# EAGLE design Mood-Light-Perhaps (EAGLE 9.6.2)
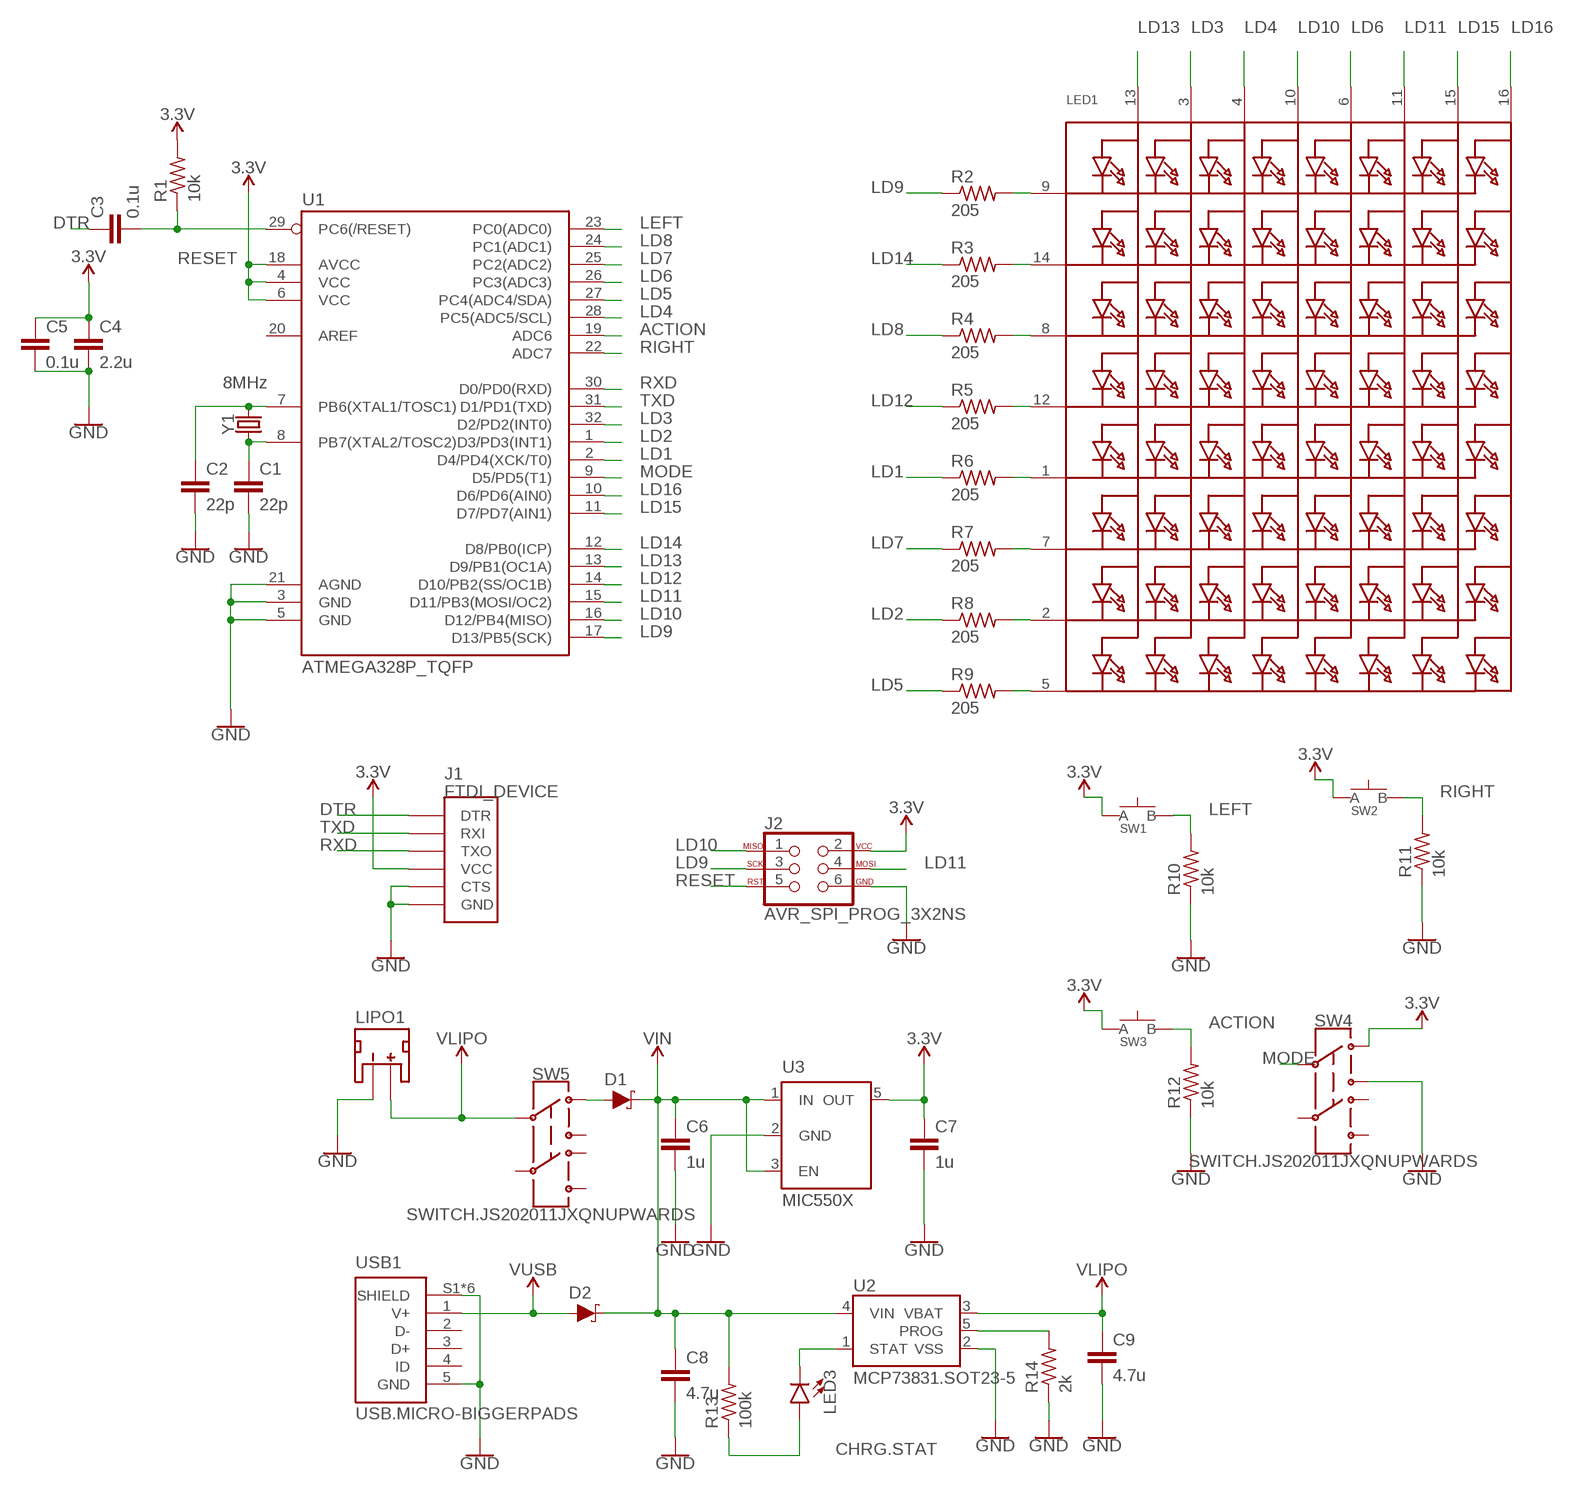
[diagram p0: schematic, sheet 1]

## Parts
C1  22p  CAPACITOR0603  [C0603]
C2  22p  CAPACITOR0603  [C0603]
C3  0.1u  CAPACITOR0603  [C0603]
C4  2.2u  CAPACITOR0603  [C0603]
C5  0.1u  CAPACITOR0603  [C0603]
C6  1u  CAPACITOR0603  [C0603]
C7  1u  CAPACITOR0603  [C0603]
C8  4.7u  CAPACITOR0603  [C0603]
C9  4.7u  CAPACITOR0603  [C0603]
D1  SCHOTTKY-USC  [USC]
D2  SCHOTTKY-USC  [USC]
J1  FTDI_DEVICE  [FTDI_DEVICE]
J2  AVR_SPI_PROG_3X2NS  [2X3-NS]
LED1  DOTMATRIX_8X8_ROWCATHODEM12A881UR  [DOTMATRIX_BL-M12A881UR]
LED3  LED0805  [LED-0805]
LIPO1  JST_2MM_MALE  [JST-2-SMD]
R1  10k  RESISTOR0603  [R0603]
R2  205  RESISTOR0603  [R0603]
R3  205  RESISTOR0603  [R0603]
R4  205  RESISTOR0603  [R0603]
R5  205  RESISTOR0603  [R0603]
R6  205  RESISTOR0603  [R0603]
R7  205  RESISTOR0603  [R0603]
R8  205  RESISTOR0603  [R0603]
R9  205  RESISTOR0603  [R0603]
R10  10k  RESISTOR0603  [R0603]
R11  10k  RESISTOR0603  [R0603]
R12  10k  RESISTOR0603  [R0603]
R13  100k  RESISTOR0603  [R0603]
R14  2k  RESISTOR0603  [R0603]
SW1  SPST.KT11P4SM34LFS  [SPST.KT11P4SM34LFS]
SW2  SPST.KT11P4SM34LFS  [SPST.KT11P4SM34LFS]
SW3  SPST.KT11P4SM34LFS  [SPST.KT11P4SM34LFS]
SW4  SWITCH.JS202011JXQNUPWARDS  [SWITCH.00]
SW5  SWITCH.JS202011JXQNUPWARDS  [SWITCH.00]
U1  ATMEGA328P_TQFP  [TQFP32-08]
U2  MCP73831.SOT23-5  [SOT23-5]
U3  MIC550X  [SOT23-5]
USB1  USB.MICRO-BIGGERPADS  [USB-MICRO-01.BIGGERPADS]
Y1  8MHz  CRYSTAL-CA-310  [CA-301]

## Nets
3.3V: C4.1 C5.1 C7.1 J1.VCC J2.2 R1.2 SW1.1(A) SW1.2(A) SW2.1(A) SW2.2(A) SW3.1(A) SW3.2(A) SW4.1 U1.4(VCC) U1.6(VCC) U1.18(AVCC) U3.5(OUT)
ACTION: R12.2 SW3.3(B) SW3.4(B) U1.19(ADC6)
CHRG.STAT: LED3.A R13.1
DTR: C3.1 J1.DTR
GND: C1.2 C2.2 C4.2 C5.2 C6.2 C7.2 C8.2 C9.2 J1.CTS J1.GND J2.6 LIPO1.1(-) R10.1 R11.1 R12.1 R14.1 SW4.3 U1.3(GND) U1.5(GND) U1.21(AGND) U2.2(VSS) U3.2(GND) USB1.5(GND) USB1.S1(SHIELD) USB1.S2(SHIELD) USB1.S3(SHIELD) USB1.S4(SHIELD) USB1.S5(SHIELD) USB1.S6(SHIELD)
LD1: R6.1 U1.2(D4/PD4(XCK/T0))
LD2: R8.1 U1.1(D3/PD3(INT1))
LD3: LED1.3(A2) U1.32(D2/PD2(INT0))
LD4: LED1.4(A3) U1.28(PC5(ADC5/SCL))
LD5: R9.1 U1.27(PC4(ADC4/SDA))
LD6: LED1.6(A5) U1.26(PC3(ADC3))
LD7: R7.1 U1.25(PC2(ADC2))
LD8: R4.1 U1.24(PC1(ADC1))
LD9: J2.3 R2.1 U1.17(D13/PB5(SCK))
LD10: J2.1 LED1.10(A4) U1.16(D12/PB4(MISO))
LD11: J2.4 LED1.11(A6) U1.15(D11/PB3(MOSI/OC2))
LD12: R5.1 U1.14(D10/PB2(SS/OC1B))
LD13: LED1.13(A1) U1.13(D9/PB1(OC1A))
LD14: R3.1 U1.12(D8/PB0(ICP))
LD15: LED1.15(A7) U1.11(D7/PD7(AIN1))
LD16: LED1.16(A8) U1.10(D6/PD6(AIN0))
LEFT: R10.2 SW1.3(B) SW1.4(B) U1.23(PC0(ADC0))
MODE: SW4.2 U1.9(D5/PD5(T1))
N$1: LED1.9(K1) R2.2
N$2: C2.1 U1.7(PB6(XTAL1/TOSC1)) Y1.2
N$3: C1.1 U1.8(PB7(XTAL2/TOSC2)) Y1.1
N$4: LED1.14(K2) R3.2
N$5: LED1.8(K3) R4.2
N$6: LED1.12(K4) R5.2
N$7: LED1.1(K5) R6.2
N$8: LED1.7(K6) R7.2
N$9: LED1.2(K7) R8.2
N$10: LED1.5(K8) R9.2
N$12: R14.2 U2.5(PROG)
N$13: D1.+(A) SW5.1
N$16: LED3.C U2.1(STAT)
RESET: C3.2 J2.5 R1.1 U1.29(PC6(/RESET))
RIGHT: R11.2 SW2.3(B) SW2.4(B) U1.22(ADC7)
RXD: J1.RXI(TXO) U1.30(D0/PD0(RXD))
TXD: J1.TXO(RXI) U1.31(D1/PD1(TXD))
V_USB: D2.+(A) USB1.1(V+) ; supply symbol labelled VUSB
VIN: C6.1 C8.1 D1.-(C) D2.-(C) R13.2 U2.4(VIN) U3.1(IN) U3.3(EN)
VLIPO: C9.1 LIPO1.2(+) SW5.2 U2.3(VBAT)
Unconnected: LIPO1.NC1(PAD1) LIPO1.NC2(PAD2) SW4.5 SW4.6 SW4.7 SW5.3 SW5.5 SW5.6 SW5.7 U1.20(AREF) USB1.2(D-) USB1.3(D+) USB1.4(ID)

## Library data of the parts
C1-C9 = LinnesLab-Passives:CAPACITOR
D1 D2 = LinnesLab-DiscreteSemi:SCHOTTKY: Schottky diode A Schottky diode is a semiconductor diode which has a low forward voltage drop and a very fast switching action. Example: Digi-Key Part Number: RB161MM-20CT-ND CST2 footprint - Manufacturer Part Number: CTS05S40,L3F
J1 = LinnesLab-Connectors:FTDI_DEVICE
J2 = LinnesLab-Connectors:AVR_SPI_PROG_3X2: AVR ISP 6 Pin This is the reduced ISP connector for AVR programming. Common on Arduino. This footprint will take up less PCB space and can be used with a 10-pin to 6-pin adapter such as SKU: BOB-08508 **Special note about "TEST_POINT" package. The stop mask is on the top side, so if you want your programming test points to be on the bottom of your board, make sure to place this package on the bottom side of the board. This also ensure that the orientation to program from the bottom side will be correct. SparkFun Products: SparkFun ISP Pogo Adapter <https://www.sparkfun.com/products/11591> - NS Tiny AVR Programmer <https://www.sparkfun.com/products/11801> -PTH
LED1 = LinnesLab-Displays:DOTMATRIX_8X8_ROWCATHODE: 8x8 LED Segment Displays: Row = Cathode 0.7" Red 8X8 Matrix, 1.9mm Round LEDs - BL-M07C881UR 1.2" Red 8x8 Matrix, 3.0mm Round LEDs - BL-M12A881UR 1.2" Red 8x8 Matrix, 3.0mm Square LEDs - BL-M12A883
LED3 = LinnesLab-LED:LED: LED (Generic) Standard schematic elements and footprints for 5mm, 3mm, 1206, and 0603 sized LEDs. Generic LEDs with no color specified. LTST-C190KGKT: arrow indicates cathode
LIPO1 = LinnesLab-Connectors:JST_2MM_MALE: JST 2MM MALE RA CONNECTOR Two pin, compact surface mount connector. Commonly used as a battery input connection point. We really like the solid locking feeling and high current rating on these small connectors. We use these all the time as battery connectors. Mates to single-cell LiPo batteries. Here is the connector we sell at SparkFun: JST Right Angle Connector - White <https://www.sparkfun.com/products/8612> (PRT-08612) Datasheet <http://www.sparkfun.com/datasheets/Prototyping/Connectors/JST-Horizontal.pdf> It was used on these SparkFun products: SparkFun MOSFET Power Controller <https://www.sparkfun.com/products/11214> (PRT-11214) SparkFun Battery Babysitter - LiPo Battery Manager <https://www.sparkfun.com/products/13777> (PRT-13777) And many, many others that required a lipo battery connection.; PROD_ID: CONN-11443; SF_ID: PRT-08612
R1-R14 = LinnesLab-Passives:RESISTOR
SW1-SW3 = LinnesLab-Switches:SPST.KT11P4SM34LFS: https://www.ckswitches.com/media/1468/kt.pdf
SW4 SW5 = LinnesLab-Switches:SWITCH.JS202011JXQN: Manufacturer's Part Numer: JS202011JAQN for right angle throw JS202011JCQN for top side throw
U1 = LinnesLab-Microcontrollers:ATMEGA328P_TQFP: Popular 328P in QFP Storefront component: ATmega328 - TQFP <https://www.sparkfun.com/products/13448> (COM-13448) Datasheet <http://www.sparkfun.com/datasheets/Components/SMD/ATMega328.pdf> SparkFun Products SparkFun RedBoard - Programmed with Arduino <https://www.sparkfun.com/products/12757> (DEV-12757) Arduino Pro Mini 328 - 5V/16MHz <https://www.sparkfun.com/products/11113> (DEV-11113) Arduino Pro Mini 328 - 3.3V/8MHz <https://www.sparkfun.com/products/11114> (DEV-11114) SparkFun OpenLog <https://www.sparkfun.com/products/13712> (DEV-13712) SparkFun MicroView - OLED Arduino Module <https://www.sparkfun.com/products/12923> (DEV-12923) SparkFun Digital Sandbox <https://www.sparkfun.com/products/12651> (DEV-12651) SparkFun PicoBoard <https://www.sparkfun.com/products/11888> (WIG-11888) Arduino Fio <https://www.sparkfun.com/products/10116> (DEV-10116) LilyPad Arduino 328 Main Board <https://www.sparkfun.com/products/13342> (DEV-13342) SparkFun RedStick <https://www.sparkfun.com/products/13741> (DEV-13741) LilyPad MP3 <https://www.sparkfun.com/products/11013> (DEV-11013) LilyPad Arduino SimpleSnap <https://www.sparkfun.com/products/10941> (DEV-10941) SparkFun Stepoko <https://www.sparkfun.com/products/13899> (ROB-13899) SparkFun Geiger Counter <https://www.sparkfun.com/products/11345> (SEN-11345) SparkFun EL Sequencer <https://www.sparkfun.com/products/12781> (COM-12781) Arduino Pro 328 - 5V/16MHz <https://www.sparkfun.com/products/10915> (DEV-10915) CryptoCape <https://www.sparkfun.com/products/12773> (DEV-12773) SparkFun IR Thermometer Evaluation Board - MLX90614 <https://www.sparkfun.com/products/10740> (SEN-10740) SparkFun RedBot Mainboard <https://www.sparkfun.com/products/12097> (ROB-12097) Arduino Pro 328 - 3.3V/8MHz <https://www.sparkfun.com/products/10914> (DEV-10914) SparkFun Block for Intel® Edison - Arduino <https://www.sparkfun.com/products/13036> (DEV-13036) SparkFun Simon Says - Surface Mount Soldering Kit <https://www.sparkfun.com/products/10935> (KIT-10935) SparkFun 7-Segment Serial Display - Red <https://www.sparkfun.com/products/11441> (COM-11441) SparkFun 7-Segment Serial Display - White <https://www.sparkfun.com/products/11629> (COM-11629) SparkFun 7-Segment Serial Display - Yellow <https://www.sparkfun.com/products/11443> (COM-11443) SparkFun 7-Segment Serial Display - Kelly Green <https://www.sparkfun.com/products/11440> (COM-11440) SparkFun 7-Segment Serial Display - Blue <https://www.sparkfun.com/products/11442> (COM-11442) SparkFun OpenSegment Serial Display - 20mm (Blue) <https://www.sparkfun.com/products/11647> (COM-11647) SparkFun OpenSegment Serial Display - 20mm (Green) <https://www.sparkfun.com/products/11646> (COM-11646) SparkFun OpenSegment Serial Display - 20mm (White) <https://www.sparkfun.com/products/11648> (COM-11648) SparkFun OpenSegment Serial Display - 20mm (Red) <https://www.sparkfun.com/products/11644> (COM-11644) SparkFun OpenSegment Serial Display - 20mm (Yellow) <https://www.sparkfun.com/products/11645> (COM-11645) SparkFun OpenSegment Shield <https://www.sparkfun.com/products/13190> (DEV-13190); PROD_ID: IC-09069
U2 = LinnesLab-Power:MCP73831
U3 = LinnesLab-Power:MIC550X: MIC5504 Voltage Regulator Output Voltages: 1.0V to 3.3V Input Voltages: 2.5V to 5.5V Link to Datasheet http://ww1.microchip.com/downloads/en/DeviceDoc/MIC550X.pdf
USB1 = LinnesLab-Connectors:USB.MICRO: DigiKey PN: 609-4613-1-ND
Y1 = LinnesLab-Clocks:CRYSTAL-CA-310

## Board
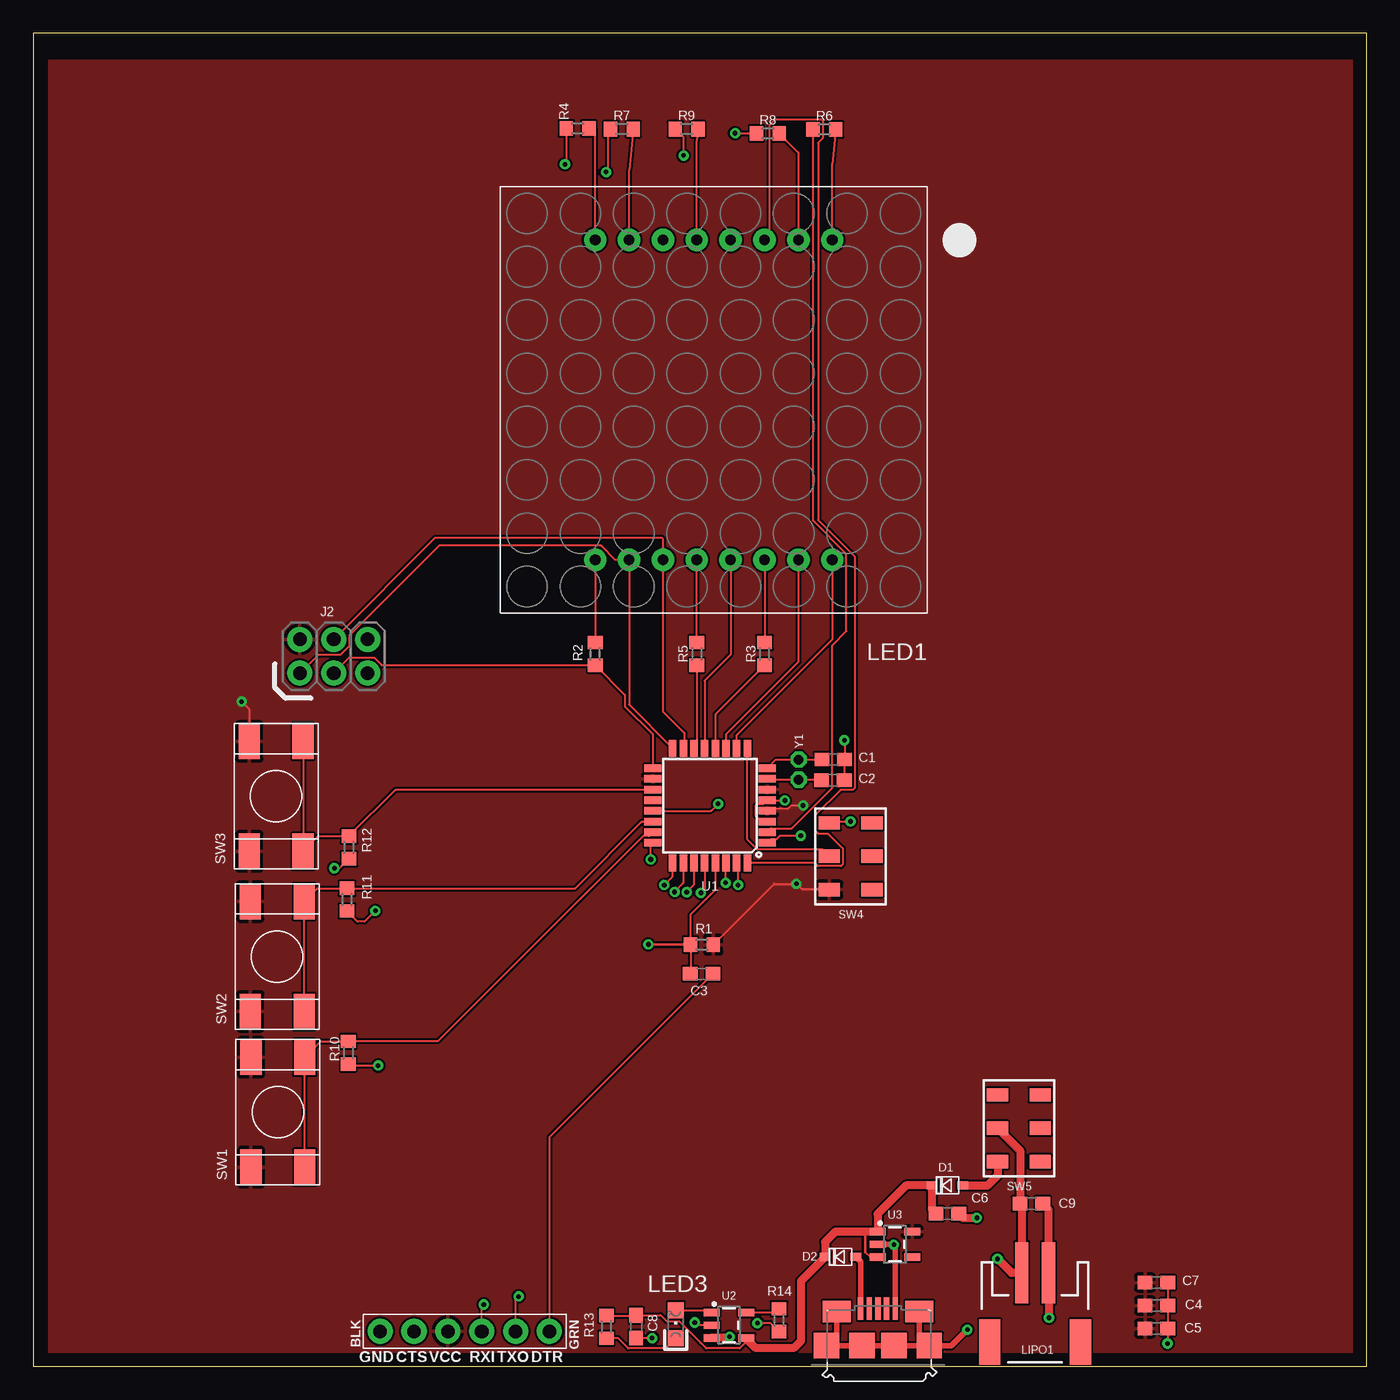
[diagram p1: board, top side]
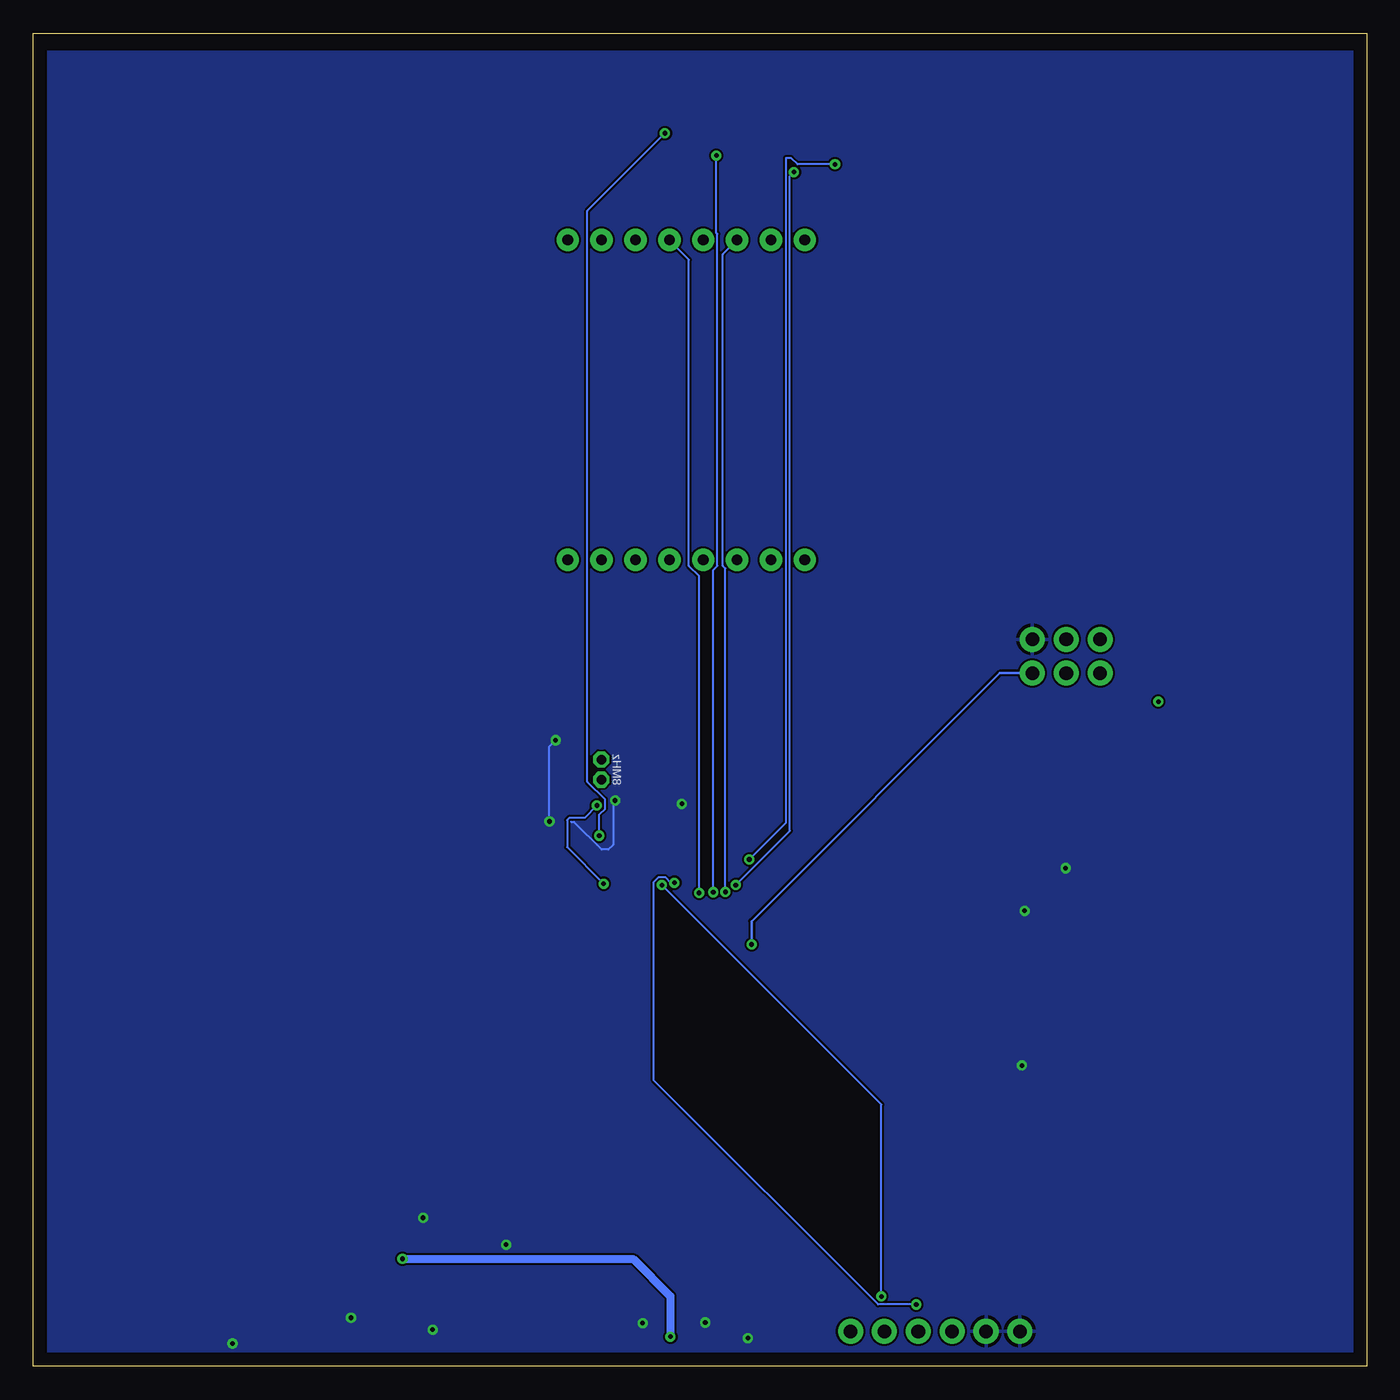
[diagram p2: board, bottom side, seen from below]

Size 100 x 100 mm. Coordinates in mm from the lower left corner, seen from the top.
Outline: 0,0 100,0 100,100 0,100 0,0
Copper layers (1*16): Top 0.035mm / dielectric 1.5mm / Bottom 0.035mm
Design rules "default": minimum track width 6mil, minimum drill 0.35mm, track to track 6mil, track to pad 6mil, pad to pad 6mil, via to via 6mil, smd to smd 6mil, copper to edge 40mil, drill to drill 6mil, minimum pad ring 10mil, minimum via ring 8mil, stop-mask expansion 4mil, vias tented up to drill 0mil, thermal gap 10mil

### Footprints (pad centres in the part's own frame; a part is rotated, then mirrored left to right if it is on the bottom)
C0603 = smd 1.1 x 1: 1 -0.85,0; 2 0.85,0
USC = smd 0.8 x 0.6: + -1.15,0; - 1.15,0
FTDI_DEVICE = drill 1.016 pad 1.88: CTS 3.81,0; DTR -6.35,0; GND 6.35,0; RXI -1.27,0; TXO -3.81,0; VCC 1.27,0
2X3-NS = drill 1.016 pad 1.88: 1 -2.54,-1.27; 2 -2.54,1.27; 3 0,-1.27; 4 0,1.27; 5 2.54,-1.27; 6 2.54,1.27
DOTMATRIX_BL-M12A881UR = drill 0.8 pad 1.676: 1 -8.89,-12; 2 -6.35,-12; 3 -3.81,-12; 4 -1.27,-12; 5 1.27,-12; 6 3.81,-12; 7 6.35,-12; 8 8.89,-12; 9 8.89,12; 10 6.35,12; 11 3.81,12; 12 1.27,12; 13 -1.27,12; 14 -3.81,12; 15 -6.35,12; 16 -8.89,12
LED-0805 = smd 1.2 x 1.2: A 0,-1.05; C 0,1.05
JST-2-SMD = smd 1 x 4.6: 1 -1,-3.7; 2 1,-3.7 | smd 1.6 x 3.4: NC1 -3.4,1.5; NC2 3.4,1.5
R0603 = smd 1 x 1.1: 1 -0.85,0; 2 0.85,0
SPST.KT11P4SM34LFS = smd 2.665 x 1.59: 1 -4.128,2.02; 2 4.128,2.02; 3 -4.128,-2.02; 4 4.128,-2.02
SWITCH.00 = smd 1 x 1.6: 1 -2.5,1.6; 2 0,1.6; 3 2.5,1.6; 5 -2.5,-1.6; 6 0,-1.6; 7 2.5,-1.6
TQFP32-08 = smd 1.27 x 0.559: 1 -4.293,2.8; 2 -4.293,2; 3 -4.293,1.2; 4 -4.293,0.4; 5 -4.293,-0.4; 6 -4.293,-1.2; 7 -4.293,-2; 8 -4.293,-2.8; 17 4.293,-2.8; 18 4.293,-2; 19 4.293,-1.2; 20 4.293,-0.4; 21 4.293,0.4; 22 4.293,1.2; 23 4.293,2; 24 4.293,2.8 | smd 0.559 x 1.27: 9 -2.8,-4.293; 10 -2,-4.293; 11 -1.2,-4.293; 12 -0.4,-4.293; 13 0.4,-4.293; 14 1.2,-4.293; 15 2,-4.293; 16 2.8,-4.293; 25 2.8,4.293; 26 2,4.293; 27 1.2,4.293; 28 0.4,4.293; 29 -0.4,4.293; 30 -1.2,4.293; 31 -2,4.293; 32 -2.8,4.293
SOT23-5 = smd 0.55 x 1.2: 1 -0.95,-1.3; 2 0,-1.3; 3 0.95,-1.3; 4 0.95,1.3; 5 -0.95,1.3
USB-MICRO-01.BIGGERPADS = smd 0.4 x 1.7: 1 -1.3,1.505; 2 -0.65,1.505; 3 0,1.505; 4 0.65,1.505; 5 1.3,1.505 | smd 1.9 x 1.9: S1 -3.85,-1.27; S2 -1.2,-1.27; S3 1.2,-1.27; S4 3.85,-1.27 | smd 2.1 x 1.6: S5 -3.1,1.28; S6 3.1,1.28
CA-301 = drill 0.711 octagon: 1 0,0; 2 1.524,0

### Placement (x,y rotation side)
C1  59.99,45.52 0 top
C2  59.97,43.97 0 top
C3  50.11,29.44 180 top
C4  84.23,4.55 0 top
C5  84.23,2.82 0 top
C6  68.55,11.46 0 top
C7  84.23,6.27 0 top
C8  45.21,2.97 270 top
C9  74.85,12.19 0 top
D1  68.55,13.56 180 top
D2  60.53,8.2 180 top
J1  32.36,2.62 180 top
J2  22.53,53.26 0 top
LED1  51.03,72.49 180 top
LED3  48.18,3.15 0 top
LIPO1  75.13,3.3 180 top
R1  50.14,31.62 0 top
R2  42.14,53.44 90 top
R3  54.84,53.44 90 top
R4  40.82,92.86 0 top
R5  49.76,53.44 90 top
R6  59.33,92.79 0 top
R7  44.15,92.81 0 top
R8  55.09,92.48 0 top
R9  49,92.81 0 top
R10  23.62,23.52 90 top
R11  23.52,35 90 top
R12  23.67,38.91 90 top
R13  42.98,2.95 90 top
R14  55.93,3.45 90 top
SW1  18.34,19.05 90 top
SW2  18.29,30.73 90 top
SW3  18.21,42.75 90 top
SW4  61.29,38.25 90 top
SW5  73.91,17.86 90 top
U1  50.75,42.06 180 top
U2  52.17,3.07 270 top
U3  64.62,9.14 270 top
USB1  63.35,2.82 0 top
Y1  57.4,45.52 270 top

### Tracks (layer width: path | path; a pad name or v marks a point on that pad's centre or on a via)
3.3V  (via drill 0.35)
  Top 0.152: v57.73,42.06 56.84,42.06 56.61,41.84 55.22,41.84 U1.4 | SW4.1 57.67,35.75 v57.23,36.2 55.56,36.2 R1.2 | v15.62,49.86 16.19,49.29 SW3.2
  Bottom 0.152: v57.73,42.06 58.65,41.15 59.79,41.15 59.97,40.97 59.97,38.94 v57.23,36.2
  pour Top: 1.19,97.97 99.52,97.97 99.52,0.25 0.38,0.25 0.38,0.33 1.19,0.33
ACTION
  Top 0.152: SW3.4 SW3.3 21.37,39.76 R12.2 27.17,43.26 U1.19
CHRG.STAT
  Top 0.152: R13.1 43.86,2.1 44.62,1.34 47.43,1.34 LED3.A
DTR
  Top 0.152: C3.1 38.71,17.18 J1.DTR
GND  (via drill 0.35)
  Top 0.152: R11.1 24.31,33.36 24.86,33.36 v25.65,34.16 | R10.1 23.74,22.55 v25.86,22.55 | 50.82,3.12 U2.2 49.81,3.07 v49.61,3.28 | R14.1 55.3,3.23 v54.31,3.23 | USB1.S4 66.45,2.3 | C7.2 C4.2 C5.2 85.08,1.71 v85.06,1.7 | 64.52,9.14 v64.54,9.12 | C9.2 76.13,11.76 | LIPO1.1 76.17,6.96 | C8.2 46.39,2.12 v46.41,2.11 | v56.36,42.44 56.34,42.46 U1.5 54.75,42.17 54.31,42.17 54.18,42.04 54.18,41.29 54.6,40.86 U1.3 | SW4.3 59.81,40.87 v61.29,40.87 | C2.2 60.84,43.99 C1.2 60.84,46.95 v60.83,46.97 | U1.21 50.83,41.66 v51.36,42.19 | R12.1 22.97,37.36 v22.58,37.36
  Top 0.406: USB1.S5 60.25,2.3 USB1.S1 USB1.S2 USB1.S3 USB1.S4 68.86,1.55 v70.05,2.74 | 66.45,2.3 USB1.S6 | U3.2 64.52,9.14 64.65,9.01 USB1.5
  Top 0.61: 76.13,11.76 LIPO1.1 | 76.17,6.96 v76.17,3.63 | C6.2 69.73,11.12 v70.76,11.12
  Bottom 0.152: v56.36,42.44 56.52,42.29 56.52,39.11 56.87,38.75 57.38,38.75 59.47,40.84 59.66,40.84 | v61.29,40.87 61.29,46.51 v60.83,46.97
  pour Bottom: 1.3,98.6 99.26,98.6 99.26,0.58 0.71,0.58 0.71,0.86 0.71,98.6
LD1
  Top 0.152: U1.2 55.33,40.35 56.88,40.35 59.92,43.4 59.92,54.08 60.98,55.14 60.98,60.93 58.48,63.43 R6.1
LD2  (via drill 0.35)
  Top 0.152: U1.1 55.33,39.55 55.77,39.55 56.02,39.8 v57.56,39.8 | v52.63,92.51 54.22,92.51 R8.1
  Bottom 0.152: v57.56,39.8 57.56,41.38 57.12,41.81 57.12,42.53 58.45,43.85 58.45,86.69 v52.63,92.51
LD3
  Top 0.152: U1.32 58.55,37.77 58.8,37.52 60.59,37.52 60.72,37.66 60.72,38.85 59.6,39.97 58.85,39.97 58.66,40.16 58.66,41.35 60.55,43.24 61.46,43.24 61.62,43.4 61.62,60.73 58.85,63.5 58.85,91.78 59.21,92.14 59.21,93.43 59.08,93.56 55.65,93.56 55.21,93.13 55.21,84.87 LED1.3
LD4  (via drill 0.35)
  Top 0.152: U1.28 50.35,35.8 v50.06,35.51
  Bottom 0.152: v50.06,35.51 50.06,59.29 50.83,60.05 50.83,83.02 LED1.4
LD5  (via drill 0.35)
  Top 0.152: U1.27 49.55,36.11 v49,35.56 | v48.77,90.83 48.77,92.19 R9.1
  Bottom 0.152: v49,35.56 49,59.74 48.69,60.05 48.69,84.93 48.77,85.01 v48.77,90.83
LD6  (via drill 0.35)
  Top 0.152: U1.26 48.75,36.24 v48.09,35.59
  Bottom 0.152: v48.09,35.59 48.09,59.86 48.28,60.05 48.28,83.42 LED1.6
LD7  (via drill 0.35)
  Top 0.152: v47.32,36.09 47.95,36.73 U1.25 | R7.1 43.1,92.62 43.1,89.74 v42.95,89.59
  Bottom 0.152: v47.32,36.09 43.26,40.16 43.26,89.29 v42.95,89.59
LD8  (via drill 0.35)
  Top 0.152: R4.1 39.97,90.26 v39.88,90.17 | v46.3,38.02 46.3,39.11 U1.24
  Bottom 0.152: v46.3,38.02 43.56,40.77 43.56,90.65 43.16,90.65 42.68,90.17 v39.88,90.17
LD9
  Top 0.152: U1.17 46.46,47.42 44.37,49.5 44.37,50.36 R2.1 26.12,52.59 25.55,53.16 23.7,53.16 J2.3
LD10
  Top 0.152: U1.16 44.68,49.63 LED1.10 43.65,60.49 42.58,61.56 30.44,61.56 23.7,54.81 23.7,54.05 23.01,53.37 21.36,53.37 J2.1
LD11
  Top 0.152: U1.15 48.82,46.42 48.82,47.52 47.22,49.12 LED1.11 47.22,62.08 47.14,62.15 30.15,62.15 J2.4
LD12
  Top 0.152: R5.1 49.76,46.56 U1.14
LD13
  Top 0.152: LED1.13 52.3,53.39 50.35,51.44 U1.13
LD14
  Top 0.152: R3.1 51.15,48.9 U1.12
LD15
  Top 0.152: LED1.15 57.38,52.83 51.94,47.4 U1.11
LD16
  Top 0.152: LED1.16 59.92,54.51 52.73,47.32 52.73,46.37 U1.10
LEFT
  Top 0.152: SW1.3 SW1.4 21.55,24.37 R10.2 30.33,24.37 45.73,39.77 46.16,39.77 U1.23
MODE
  Top 0.152: SW4.2 59.19,38.75 54.31,38.75 53.55,39.52 U1.9
N$1
  Top 0.152: LED1.9 R2.2
N$2
  Top 0.152: U1.7 55.12,43.99 Y1.2 59.09,43.99 C2.1
N$3
  Top 0.152: U1.8 55.7,45.52 Y1.1 C1.1
N$4
  Top 0.152: LED1.14 R3.2
N$5
  Top 0.152: LED1.8 42.14,92.81 R4.2
N$6
  Top 0.152: R5.2 LED1.12
N$7
  Top 0.152: LED1.1 59.92,90.18 R6.2
N$8
  Top 0.152: LED1.7 44.68,89.71 R7.2
N$9
  Top 0.152: R8.2 57.38,91.05 LED1.2
N$10
  Top 0.152: R9.2 49.76,91.95 LED1.5
N$12
  Top 0.152: R14.2 55.65,4.02 U2.5
N$13
  Top 0.406: 69.73,13.54 D1.+
  Top 0.61: SW5.1 72.31,14.3 71.55,13.54 69.73,13.54
N$16
  Top 0.152: LED3.C 50.7,4.2 U2.1
RESET  (via drill 0.35)
  Top 0.152: U1.29 51.15,35.73 49.28,33.86 49.28,31.64 R1.1 49.29,29.46 C3.2
  Top 0.203: v46.13,31.65 49.26,31.65 R1.1
  Bottom 0.203: J2.5 27.51,51.99 46.13,33.38 v46.13,31.65
RIGHT
  Top 0.152: SW2.3 SW2.4 21.3,35.85 R11.2 40.63,35.85 45.64,40.86 U1.22
RXD  (via drill 0.35)
  Top 0.152: J1.RXI 33.63,4.47 v33.78,4.62 | v51.92,36.27 51.92,37.74 U1.30
  Bottom 0.152: v33.78,4.62 v33.78,4.63 36.65,4.63 53.46,21.44 53.46,36.34 53.11,36.7 52.61,36.7 52.18,36.27 v51.92,36.27
TXD  (via drill 0.35)
  Top 0.152: J1.TXO 36.17,5 v36.4,5.23 | v52.86,36.09 52.86,37.66 U1.31
  Bottom 0.152: v36.4,5.23 36.4,19.63 v52.86,36.09
V_USB
  Top 0.406: D2.+ 62.05,7.83 USB1.1
VIN
  Top 0.152: R13.2 45.19,3.8 C8.1 47.04,3.82 47.49,3.37 48.44,3.37 50.04,1.76 50.04,1.75 50.46,1.34 52.96,1.34 53.47,1.85 53.47,2.06 U2.4
  Top 0.203: U3.3 62.77,8.19 62.41,8.56 62.41,10.04 62.46,10.09
  Top 0.61: 53.47,2.06 54.18,1.35 57.02,1.35 57.56,1.88 57.56,6.38 D2.- 59.38,9.31 60.16,10.09 62.46,10.09 U3.1 63.32,11.43 65.46,13.56 D1.- 67.41,11.76 C6.1
VLIPO  (via drill 0.35)
  Top 0.61: SW5.2 74,16.17 C9.1 74.13,12.06 LIPO1.2 73.36,7 v72.31,8.05 | v52.22,2.21 52.16,2.15 50.9,2.15 U2.3
  Bottom 0.61: v72.31,8.05 55.02,8.05 52.22,5.25 v52.22,2.21